# EAGLE board MicroBoardMk2 (EAGLE 7.2.0)
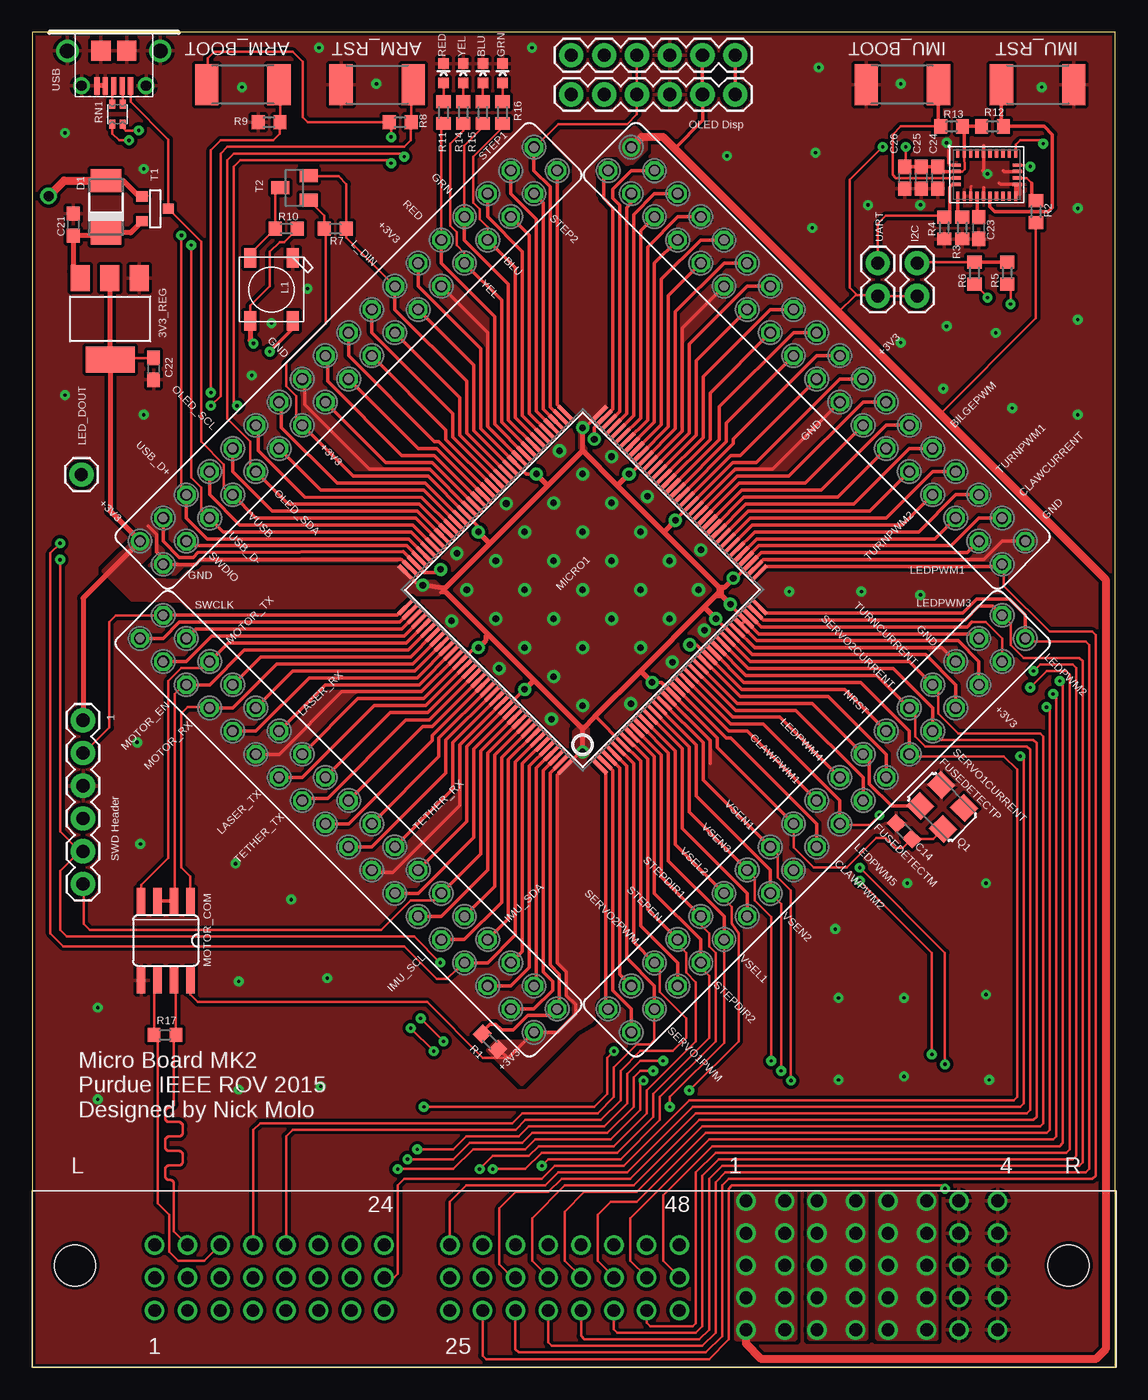
[diagram p4: board, top side]
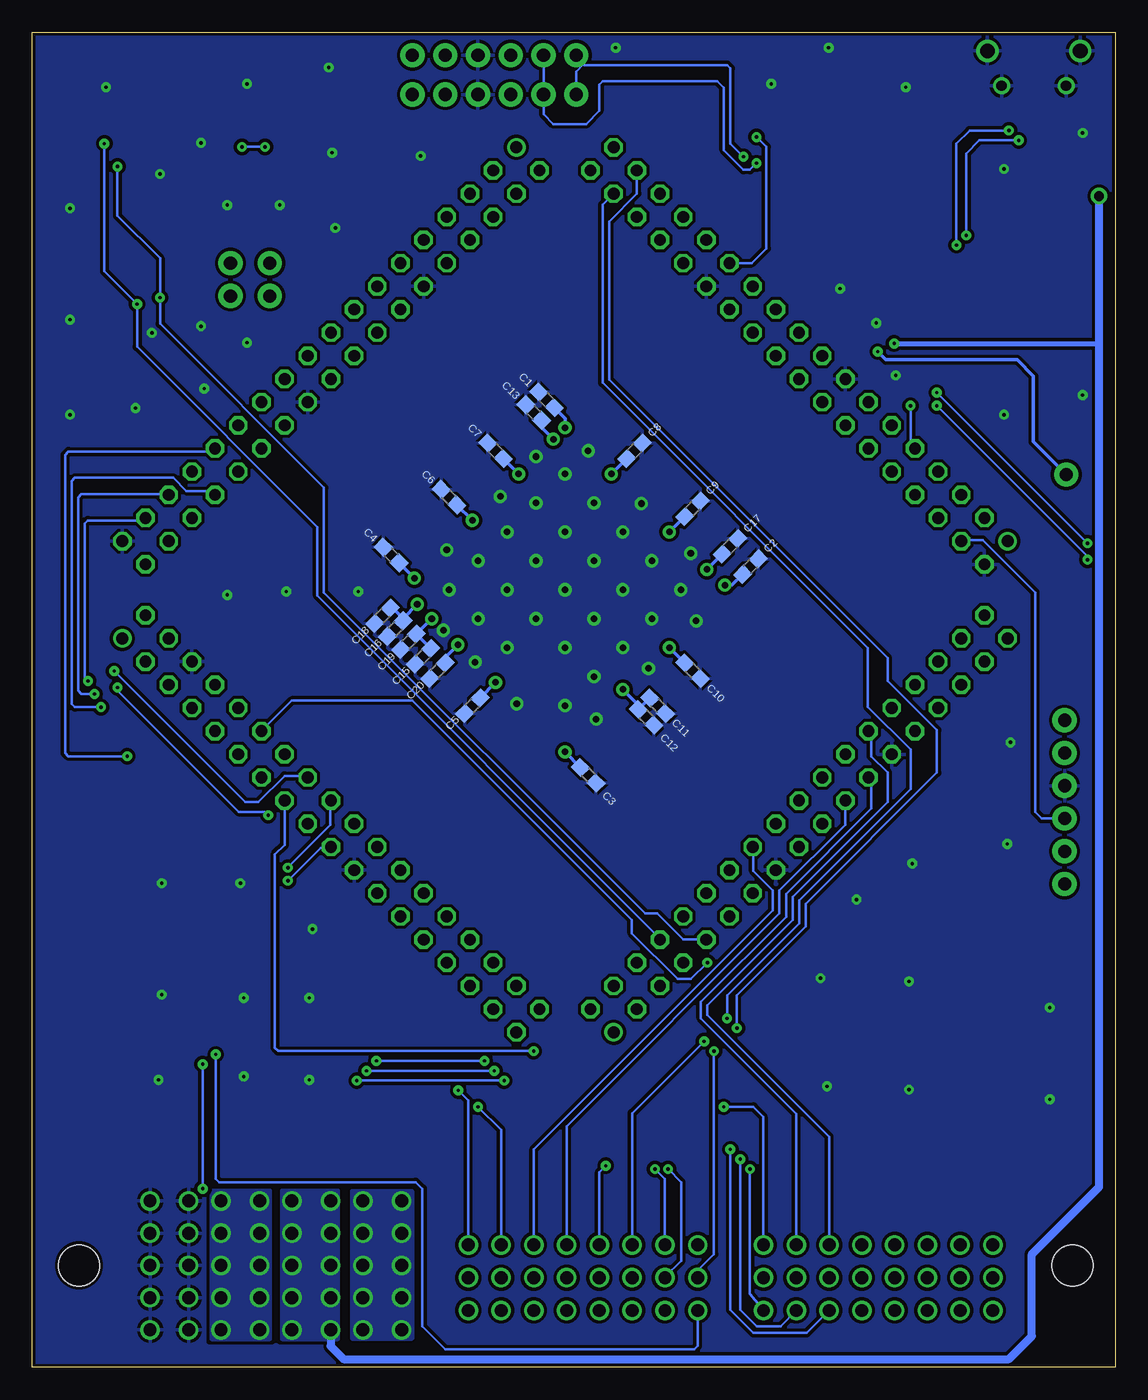
[diagram p5: board, bottom side, seen from below]

Size 83.95 x 103.5 mm. Coordinates in mm from the lower left corner, seen from the top.
Outline: 0,0 83.95,0 83.95,103.5 0,103.5 0,0
Copper layers (1*16): Top 0.035mm / dielectric 1.5mm / Bottom 0.035mm
Design rules "GoldPhoenix *": minimum track width 7mil, minimum drill 10mil, track to track 7mil, track to pad 7mil, pad to pad 7mil, via to via 7mil, smd to smd 7mil, copper to edge 10mil, drill to drill 8mil, minimum pad ring 10mil, minimum via ring 10mil, stop-mask expansion 4mil, vias tented up to drill 25mil, thermal gap 10mil

## Footprints (pad centres in the part's own frame; a part is rotated, then mirrored left to right if it is on the bottom)
SOT223 = smd 1.499 x 2.007: 1 -2.261,-3.15; 2 0.025,-3.15; 3 2.311,-3.15 | smd 3.81 x 2.007: 4 0,3.15
TEN60-S24-S24-P4-RA = drill 1: P1.1 55.32,12.9; P1.2 55.32,10.4; P1.3 55.32,7.9; P1.4 55.32,5.4; P1.5 55.32,2.9; P1.6 58.32,2.9; P1.7 58.32,5.4; P1.8 58.32,7.9; P1.9 58.32,10.4; P1.10 58.32,12.9; P2.1 60.82,12.9; P2.2 60.82,10.4; P2.3 60.82,7.9; P2.4 60.82,5.4; P2.5 60.82,2.9; P2.6 63.82,2.9; P2.7 63.82,5.4; P2.8 63.82,7.9; P2.9 63.82,10.4; P2.10 63.82,12.9; P3.1 66.32,12.9; P3.2 66.32,10.4; P3.3 66.32,7.9; P3.4 66.32,5.4; P3.5 66.32,2.9; P3.6 69.32,2.9; P3.7 69.32,5.4; P3.8 69.32,7.9; P3.9 69.32,10.4; P3.10 69.32,12.9; P4.1 71.82,12.9; P4.2 71.82,10.4; P4.3 71.82,7.9; P4.4 71.82,5.4; P4.5 71.82,2.9; P4.6 74.82,2.9; P4.7 74.82,5.4; P4.8 74.82,7.9; P4.9 74.82,10.4; P4.10 74.82,12.9; S1 9.49,4.4; S2 12.03,4.4; S3 14.57,4.4; S4 17.11,4.4; S5 19.65,4.4; S6 22.19,4.4; S7 24.73,4.4; S8 27.27,4.4; S9 9.49,6.94; S10 12.03,6.94; S11 14.57,6.94; S12 17.11,6.94; S13 19.65,6.94; S14 22.19,6.94; S15 24.73,6.94; S16 27.27,6.94; S17 9.49,9.48; S18 12.03,9.48; S19 14.57,9.48; S20 17.11,9.48; S21 19.65,9.48; S22 22.19,9.48; S23 24.73,9.48; S24 27.27,9.48; S25 32.37,4.4; S26 34.91,4.4; S27 37.45,4.4; S28 39.99,4.4; S29 42.53,4.4; S30 45.07,4.4; S31 47.61,4.4; S32 50.15,4.4; S33 32.37,6.94; S34 34.91,6.94; S35 37.45,6.94; S36 39.99,6.94; S37 42.53,6.94; S38 45.07,6.94; S39 47.61,6.94; S40 50.15,6.94; S41 32.37,9.48; S42 34.91,9.48; S43 37.45,9.48; S44 39.99,9.48; S45 42.53,9.48; S46 45.07,9.48; S47 47.61,9.48; S48 50.15,9.48 | hole 3.2: 3.32,7.9; 80.32,7.9
LED-0603 = smd 0.8 x 0.8: A 0,-0.75; C 0,0.75
LGA28 = smd 0.25 x 0.675: P$1 -2.25,1.663; P$6 -2.25,-1.663; P$7 -1.75,-1.663; P$8 -1.25,-1.663; P$9 -0.75,-1.663; P$10 -0.25,-1.663; P$11 0.25,-1.663; P$12 0.75,-1.663; P$13 1.25,-1.663; P$14 1.75,-1.663; P$15 2.25,-1.663; P$20 2.25,1.663; P$21 1.75,1.663; P$22 1.25,1.663; P$23 0.75,1.663; P$24 0.25,1.663; P$25 -0.25,1.663; P$26 -0.75,1.663; P$27 -1.25,1.663; P$28 -1.75,1.663 | smd 0.675 x 0.25: P$2 -2.362,0.75; P$3 -2.362,0.25; P$4 -2.362,-0.25; P$5 -2.362,-0.75; P$16 2.362,-0.75; P$17 2.362,-0.25; P$18 2.362,0.25; P$19 2.362,0.75
SW_2512 = smd 1.8 x 3.2: 1 -2.8,0; 2 2.8,0
C0603 = smd 1.1 x 1: 1 -0.85,0; 2 0.85,0
DO-214AC = smd 1.8 x 2.4: A 2.025,0; C -2.025,0
MICRO_B = smd 1.5 x 1.55: GND1 -1,1.45; GND2 1,1.45 | drill 0.8: GND3 -2.5,4.15; GND4 2.5,4.15 | drill 1.15: GND7 -3.598,1.45; GND8 3.598,1.45 | smd 0.4 x 1.35: P1 -1.3,4.15; P2 -0.65,4.15; P3 0,4.15; P4 0.65,4.15; P5 1.3,4.15
1X01 = drill 1.016 pad 1.88: 1 0,0
1X06 = drill 1.016 pad 1.88: 1 0,0; 2 2.54,0; 3 5.08,0; 4 7.62,0; 5 10.16,0; 6 12.7,0
1X02 = drill 1.016 pad 1.88: 1 0,0; 2 2.54,0
WS2812B = smd 1.5 x 0.9: 1-VDD 2.45,-1.65; 2-DOUT 2.45,1.65; 3-GND -2.45,1.65; 4-DIN -2.45,-1.65
SQFP-S-20X20-144 = smd 0.3 x 1.6: 1 -8.75,-10.6; 2 -8.25,-10.6; 3 -7.75,-10.6; 4 -7.25,-10.6; 5 -6.75,-10.6; 6 -6.25,-10.6; 7 -5.75,-10.6; 8 -5.25,-10.6; 9 -4.75,-10.6; 10 -4.25,-10.6; 11 -3.75,-10.6; 12 -3.25,-10.6; 13 -2.75,-10.6; 14 -2.25,-10.6; 15 -1.75,-10.6; 16 -1.25,-10.6; 17 -0.75,-10.6; 18 -0.25,-10.6; 19 0.25,-10.6; 20 0.75,-10.6; 21 1.25,-10.6; 22 1.75,-10.6; 23 2.25,-10.6; 24 2.75,-10.6; 25 3.25,-10.6; 26 3.75,-10.6; 27 4.25,-10.6; 28 4.75,-10.6; 29 5.25,-10.6; 30 5.75,-10.6; 31 6.25,-10.6; 32 6.75,-10.6; 33 7.25,-10.6; 34 7.75,-10.6; 35 8.25,-10.6; 36 8.75,-10.6; 73 8.75,10.6; 74 8.25,10.6; 75 7.75,10.6; 76 7.25,10.6; 77 6.75,10.6; 78 6.25,10.6; 79 5.75,10.6; 80 5.25,10.6; 81 4.75,10.6; 82 4.25,10.6; 83 3.75,10.6; 84 3.25,10.6; 85 2.75,10.6; 86 2.25,10.6; 87 1.75,10.6; 88 1.25,10.6; 89 0.75,10.6; 90 0.25,10.6; 91 -0.25,10.6; 92 -0.75,10.6; 93 -1.25,10.6; 94 -1.75,10.6; 95 -2.25,10.6; 96 -2.75,10.6; 97 -3.25,10.6; 98 -3.75,10.6; 99 -4.25,10.6; 100 -4.75,10.6; 101 -5.25,10.6; 102 -5.75,10.6; 103 -6.25,10.6; 104 -6.75,10.6; 105 -7.25,10.6; 106 -7.75,10.6; 107 -8.25,10.6; 108 -8.75,10.6 | smd 1.6 x 0.3: 37 10.6,-8.75; 38 10.6,-8.25; 39 10.6,-7.75; 40 10.6,-7.25; 41 10.6,-6.75; 42 10.6,-6.25; 43 10.6,-5.75; 44 10.6,-5.25; 45 10.6,-4.75; 46 10.6,-4.25; 47 10.6,-3.75; 48 10.6,-3.25; 49 10.6,-2.75; 50 10.6,-2.25; 51 10.6,-1.75; 52 10.6,-1.25; 53 10.6,-0.75; 54 10.6,-0.25; 55 10.6,0.25; 56 10.6,0.75; 57 10.6,1.25; 58 10.6,1.75; 59 10.6,2.25; 60 10.6,2.75; 61 10.6,3.25; 62 10.6,3.75; 63 10.6,4.25; 64 10.6,4.75; 65 10.6,5.25; 66 10.6,5.75; 67 10.6,6.25; 68 10.6,6.75; 69 10.6,7.25; 70 10.6,7.75; 71 10.6,8.25; 72 10.6,8.75; 109 -10.6,8.75; 110 -10.6,8.25; 111 -10.6,7.75; 112 -10.6,7.25; 113 -10.6,6.75; 114 -10.6,6.25; 115 -10.6,5.75; 116 -10.6,5.25; 117 -10.6,4.75; 118 -10.6,4.25; 119 -10.6,3.75; 120 -10.6,3.25; 121 -10.6,2.75; 122 -10.6,2.25; 123 -10.6,1.75; 124 -10.6,1.25; 125 -10.6,0.75; 126 -10.6,0.25; 127 -10.6,-0.25; 128 -10.6,-0.75; 129 -10.6,-1.25; 130 -10.6,-1.75; 131 -10.6,-2.25; 132 -10.6,-2.75; 133 -10.6,-3.25; 134 -10.6,-3.75; 135 -10.6,-4.25; 136 -10.6,-4.75; 137 -10.6,-5.25; 138 -10.6,-5.75; 139 -10.6,-6.25; 140 -10.6,-6.75; 141 -10.6,-7.25; 142 -10.6,-7.75; 143 -10.6,-8.25; 144 -10.6,-8.75
SO08 = smd 0.66 x 2.032: 1 -1.905,-3.073; 2 -0.635,-3.073; 3 0.635,-3.073; 4 1.905,-3.073; 5 1.905,3.073; 6 0.635,3.073; 7 -0.635,3.073; 8 -1.905,3.073
FE18-2 = drill 0.914: 1 -21.59,1.27 | drill 0.914 octagon: 2 -21.59,-1.27; 3 -19.05,1.27; 4 -19.05,-1.27; 5 -16.51,1.27; 6 -16.51,-1.27; 7 -13.97,1.27; 8 -13.97,-1.27; 9 -11.43,1.27; 10 -11.43,-1.27; 11 -8.89,1.27; 12 -8.89,-1.27; 13 -6.35,1.27; 14 -6.35,-1.27; 15 -3.81,1.27; 16 -3.81,-1.27; 17 -1.27,1.27; 18 -1.27,-1.27; 19 1.27,1.27; 20 1.27,-1.27; 21 3.81,1.27; 22 3.81,-1.27; 23 6.35,1.27; 24 6.35,-1.27; 25 8.89,1.27; 26 8.89,-1.27; 27 11.43,1.27; 28 11.43,-1.27; 29 13.97,1.27; 30 13.97,-1.27; 31 16.51,1.27; 32 16.51,-1.27; 33 19.05,1.27; 34 19.05,-1.27; 35 21.59,1.27; 36 21.59,-1.27
ASF = smd 1.6 x 1.5: 1 -1.25,-1.15; 2 1.25,-1.15; 3 1.25,1.15; 4 -1.25,1.15
R0603 = smd 1 x 1.1: 1 -0.85,0; 2 0.85,0
EXBV4V = smd 0.45 x 0.7: 1 -0.4,-0.775; 2 0.4,-0.775; 3 0.4,0.775; 4 -0.4,0.775
SOT-23 = smd 0.787 x 0.889: 1 0.025,-1.016; 2 -0.94,1.016; 3 0.991,1.016
SOT23 = smd 1 x 1.4: 1 -0.95,-1.1; 2 0.95,-1.1; 3 0,1.1

## Placement (x,y rotation side)
3V3_REG  AP1117-3.3SOT223  [SOT223]  6.03,81.28 180 top
BACKPLANECON_  TEN60-S24-S24-P4-RA  [TEN60-S24-S24-P4-RA]  0,0 0 top
BLU  [LED-0603]  34.92,100.33 0 top
BNO055  BNO055  [LGA28]  73.98,92.46 0 top
BNO_BOOT_SW  SWITCH  [SW_2512]  67.44,99.44 180 top
BNO_RST_SW  SWITCH  [SW_2512]  77.91,99.44 0 top
BOOT_SW  SWITCH  [SW_2512]  16.32,99.44 180 top
C1  0.1uF  [C0603]  44.09,75.01 135 bottom
C2  0.1uF  [C0603]  28.29,62.07 45 bottom
C3  0.1uF  [C0603]  40.86,45.91 315 bottom
C4  0.1uF  [C0603]  56.13,62.97 135 bottom
C5  0.1uF  [C0603]  49.84,51.3 225 bottom
C6  0.1uF  [C0603]  51.64,67.46 135 bottom
C7  0.1uF  [C0603]  48.05,71.05 135 bottom
C8  0.1uF  [C0603]  37.27,71.05 45 bottom
C9  0.1uF  [C0603]  32.78,66.56 45 bottom
C10  0.1uF  [C0603]  32.78,53.99 315 bottom
C11  0.1uF  [C0603]  35.47,51.3 315 bottom
C12  4.7uF  [C0603]  36.37,50.4 315 bottom
C13  2.2uF  [C0603]  45.08,74.02 135 bottom
C14  0.01uF  [C0603]  67.58,41.57 135 top
C15  1uF  [C0603]  53.66,55.11 225 bottom
C16  10nF  [C0603]  55.81,57.27 225 bottom
C17  2.2uF  [C0603]  29.86,63.65 45 bottom
C18  1uF  [C0603]  56.8,58.26 225 bottom
C19  10nF  [C0603]  54.78,56.24 225 bottom
C20  0.1uF  [C0603]  52.54,53.99 225 bottom
C21  0.22uF  [C0603]  3.17,88.58 90 top
C22  0.22uF  [C0603]  9.4,77.41 270 top
C23  0.1uF  [C0603]  73.34,88.33 270 top
C24  0.1uF  [C0603]  70.17,92.21 270 top
C25  6.8nF  [C0603]  68.9,92.21 270 top
C26  120nF  [C0603]  67.63,92.21 270 top
D1  S1M-E3/61T  [DO-214AC]  5.71,89.98 90 top
GRN  [LED-0603]  36.45,100.33 0 top
JP1  MICROUSB  [MICRO_B]  6.32,103.5 180 top
JP2  M01PTH  [1X01]  3.81,69.22 0 top
JP4  [1X06]  41.78,98.68 0 top
JP5  [1X06]  41.78,101.73 0 top
JP6  [1X02]  68.58,83.06 90 top
JP7  [1X06]  3.94,50.16 270 top
JP8  [1X02]  65.53,85.6 270 top
L1  WS2812B  [WS2812B]  18.54,83.57 270 top
MICRO1  [SQFP-S-20X20-144]  42.66,60.28 45 top
MOTOR_COM  MAX481CSA  [SO08]  10.35,33.08 180 top
P1  [FE18-2]  24.52,42.14 135 top
P2  [FE18-2]  24.52,78.42 45 top
P3  [FE18-2]  60.8,78.42 315 top
P4  [FE18-2]  60.8,42.14 225 top
Q1  ASV-8  [ASF]  70.53,43.44 135 top
R1  0 Ohm  [R0603]  35.47,25.26 315 top
R2  4.7K  [R0603]  77.79,89.6 270 top
R3  4.7K  [R0603]  72.07,88.33 90 top
R4  4.7K  [R0603]  70.68,88.33 90 top
R5  4.7K  [R0603]  75.56,84.84 90 top
R6  4.7K  [R0603]  73.03,84.84 90 top
R7  10K  [R0603]  23.5,88.27 180 top
R8  10K  [R0603]  28.51,96.52 180 top
R9  10K  [R0603]  18.35,96.52 180 top
R10  10K  [R0603]  19.68,88.27 0 top
R11  82  [R0603]  31.88,97.28 270 top
R12  4.7K  [R0603]  74.42,96.2 180 top
R13  4.7K  [R0603]  71.25,96.2 0 top
R14  82  [R0603]  33.4,97.28 270 top
R15  82  [R0603]  34.92,97.28 270 top
R16  10  [R0603]  36.45,97.28 270 top
R17  120  [R0603]  10.29,25.78 180 top
RED  [LED-0603]  31.88,100.33 0 top
RN1  [EXBV4V]  6.6,97.16 180 top
RST_SW  SWITCH  [SW_2512]  26.73,99.44 0 top
T1  FDN340P  [SOT-23]  9.53,89.79 90 top
T2  BSS138  [SOT23]  20.32,91.44 90 top
YEL  [LED-0603]  33.4,100.33 0 top

## Tracks (layer width: path | path; a pad name or v marks a point on that pad's centre or on a via)
+3V3  (via drill 0.25, 0.51)
  Top 0.203: BNO055.P$28 72.25,94.1 72.25,94.02 72.25,92.89 72.07,92.71 BNO055.P$3 | Q1.4 69.82,40.97 C14.1 67.47,40.26 66.93,40.26 66.17,41.02 65.41,41.02 63.12,38.73 60.58,38.73 59,40.31 P4.20 | C22.1 6.16,78.26 3V3_REG.4 | v27.81,95.38 27.81,96.37 R8.2 21.34,96.52 20.95,96.9 20.95,101.22 20.19,101.98 14.1,101.98 13.59,101.47 13.59,99.51 BOOT_SW.2 | v65.91,94.61 63.37,92.08 63.37,83.69 63.94,83.12 | v67.69,94.61 67.69,93.13 C26.1 | R2.2 77.79,81.34 70.36,73.91 | R7.2 22.64,89.27 T2.1 | 22.73,88.18 22.73,80.9 19.68,77.85 19.68,76.07 20.45,75.31 20.45,73.51 P2.14 | MOTOR_COM.8 12.26,28.89 12.83,28.32 30.61,28.32 34.92,24 36.87,24 36.89,23.98 | 51.97,98.65 JP4.5 | 63.94,83.12 65.47,83.12 JP8.2 JP6.1 | 63.94,83.12 63.82,83.12 62.48,81.79
  Top 0.254: P2.25 29.91,83.81 34.75,78.96 34.75,72.78 MICRO1.84 38.27,69.26 v39.06,69.26 | P2.14 24.88,69.08 30.67,69.08 MICRO1.95 34.58,65.18 v34.58,64.77 | P1.24 25.23,51.84 30.33,51.84 MICRO1.121 34.28,55.79 v34.58,55.79 | P1.14 33.68,42.32 33.68,48.12 MICRO1.131 38.12,52.55 v38.17,52.55 | P4.31 50.02,31.36 47.15,34.23 47.15,46.99 45.77,48.36 MICRO1.6 43.7,50.4 43.55,50.4 | P4.20 53.07,48.06 53.07,48.78 48.76,53.09 v48.05,53.09 48.78,53.09 MICRO1.17 | P4.7 71.57,52.91 69.24,55.25 55.82,55.25 MICRO1.30 54.17,56.85 v52.98,58.03 | P4.5 73.37,54.71 71.75,56.33 56.15,56.33 MICRO1.32 MICRO1.33 | MICRO1.33 56.32,56.87 73.01,56.87 P4.4 | P3.34 72.47,63.15 56.49,63.15 MICRO1.39 54.52,61.18 v54.33,61.18 | P3.21 62.59,76.62 56.13,70.16 54.3,70.16 MICRO1.52 C6.1 v49.84,65.67 | P3.11 53.61,85.6 49.84,81.83 49.84,72.77 MICRO1.62 46.33,69.26 v46.25,69.26 | 52.18,58.84 52.18,59.02 | 48.94,64.77 48.94,64.8 48.97,64.8 | 38.71,53.09 39.06,53.09 | 35.18,56.69 35.47,56.69 | v42.66,47.71 42.46,47.71 MICRO1.144 | MICRO1.144 40.68,45.93 40.68,31.36 41.4,30.64 41.4,28.85 42.12,28.13 42.12,27.41 40.68,25.97 P1.1 36.89,23.98 R1.2 | MICRO1.144 42.66,47.9 | v30.26,60.64 29.91,60.64 28.98,61.57 MICRO1.108 | v42.66,72.85 42.85,72.85 MICRO1.72 | MICRO1.33 54.11,59.08 v54.11,59.16 | 53.25,60.01 53.16,60.01 | 32.1,60.05 31.66,60.05 | 32.1,60.5 31.66,60.5 | 70.22,41.74 Q1.4 | R12.2 R13.2 72.23,95.82 BNO055.P$28 | BNO055.P$3 70.45,92.71 C24.1 C25.1 C26.1 | 49.78,94.49 51.97,96.67 51.97,98.65 | 22.73,88.18 R7.2 | JP4.5 JP5.5
  Top 0.406: 53.43,60.28 53.25,60.1 | 52.98,59.83 53.16,60.01 53.25,60.1 | 52.98,59.83 52.18,59.02 52.09,58.93 | 52.09,58.93 47.15,53.99 | 47.15,53.99 43.55,50.4 42.66,49.5 | 42.66,49.5 39.06,53.09 35.47,56.69 32.1,60.05 31.88,60.28 | 31.88,60.28 32.1,60.5 35.47,63.87 | 35.47,63.87 39.96,68.36 | 39.96,68.36 42.66,71.05 | 42.66,71.05 45.35,68.36 | 45.35,68.36 48.94,64.77 53.25,60.46 | 53.25,60.46 53.43,60.28 | v38.17,52.55 38.71,53.09 | v34.58,55.79 35.18,56.39 35.18,56.69 | v34.58,64.77 35.47,63.87 | v39.06,69.26 39.96,68.36 | v46.25,69.26 45.35,68.36 | v49.84,65.67 48.97,64.8 | 47.15,53.99 v48.05,53.09 | v54.33,61.18 53.61,60.46 | 53.61,60.46 53.43,60.28 | 42.66,47.9 42.66,49.5 | 31.88,60.28 31.75,60.41 v30.26,60.64 | 42.66,71.05 v42.66,72.85 | v54.11,59.16 53.25,60.01 | 52.09,58.93 v52.98,58.03 | 52.98,59.83 53.34,59.83 53.43,59.92 53.43,60.28 | 53.61,60.46 53.25,60.46 | 53.25,60.1 53.25,60.46 | 3V3_REG.2 6.01,78.16 3V3_REG.4 6.03,66.37 P2.1 3.94,59.63 JP7.1
  Top 0.61: BACKPLANECON_.P1.5 55.32,1.83 56.52,0.64 82.42,0.64 83.19,1.4 83.19,61.09 70.36,73.91 62.48,81.79 49.78,94.49 48.9,95.38 47.22,95.38 P3.1
  Bottom 0.203: v65.91,94.61 v67.69,94.61 | P2.25 28.19,85.6 27.05,86.74 27.05,94.61 v27.81,95.38
  Bottom 0.254: 37.96,52.35 v38.17,52.55 36.97,51.36 C12.1 C11.1 | C10.1 v34.58,55.79 | v34.58,64.77 C9.1 | v39.06,69.26 C8.1 | v46.25,69.26 C7.1 | C6.1 v49.84,65.67 | C4.1 v54.33,61.18 | C3.1 v42.66,47.71 | C2.1 29.73,60.64 v30.26,60.64 | C1.1 42.66,73.57 v42.66,72.85 | C15.1 C19.1 v52.98,58.03 | v54.11,59.16 55.21,58.05 | 55.21,58.05 C16.1 | 55.21,58.05 56.02,58.86 C18.1 | C5.1 v48.05,53.09
  pour Top (isolate 0.305, no thermals): 31.88,60.28 31.52,59.92 29.01,59.92 29.01,59.56 28.29,58.84 12.12,58.84 11.59,59.38 7.72,59.47 5.48,61.71 8.44,64.68 9.61,63.51 8.26,62.16 9.34,61.09 11.41,61 12.12,61.71 12.84,61.71 13.2,62.07 28.47,62.07 29.64,60.91 31.25,60.91
  pour Top (isolate 0.305, no thermals): 59.12,2.22 59.12,13.65 54.55,13.65 54.55,2.22
  pour Top (isolate 0.305, no thermals): 42.88,70.83 42.88,73.07 44.45,74.65 44.45,89.91 43.56,90.81 43.56,93.06 44.45,93.95 45.35,93.95 46.02,93.28 46.47,93.28 47.6,94.4 47.6,95.3 46.7,96.2 41.31,96.2 40.41,95.3 40.41,94.85 41.98,93.28 41.98,91.93 41.09,91.04 41.09,74.87 42.43,73.52 42.43,71.28
  pour Top (isolate 0.305, no thermals): 41.98,49.28 42.43,49.73 42.88,49.73 43.11,49.5 43.11,46.81 44,45.91 44,28.85 43.56,28.4 43.56,27.05 43.33,26.83 42.21,26.15 37.94,21.89 35.25,24.58 35.92,25.26 38.17,25.26 38.84,25.93 40.64,25.93 41.98,27.28 41.98,28.17 41.31,28.85 41.31,30.64 40.64,31.32 40.64,45.69 42.21,47.26 42.21,47.71 41.98,47.93
  pour Bottom (isolate 0.305, no thermals): 59.12,2.22 59.12,13.65 54.55,13.65 54.55,2.22
+5V  (via drill 0.25, 0.76)
  Top 0.203: L1.1-VDD 16.89,82.3 18.41,83.82 18.41,86.49 19.18,87.25 19.52,87.25 R10.2
  Top 0.406: T1.3 8.8,90.81 8.26,90.81 7.06,92 D1.A | L1.1-VDD 16.89,79.63 v17.14,79.38
  Top 0.61: v1.27,90.81 2.47,92 D1.A
  Bottom 0.406: v17.14,79.38 1.27,79.38
  Bottom 0.61: v1.27,90.81 1.27,79.38 1.27,13.97 6.48,8.76 6.48,2.41 8.26,0.64 59.82,0.64 60.82,1.64 BACKPLANECON_.P2.5
  pour Top (isolate 0.305, no thermals): 60.26,2.22 60.26,13.65 64.58,13.65 64.58,2.22
  pour Bottom (isolate 0.305, no thermals): 60.26,2.22 60.26,13.65 64.58,13.65 64.58,2.22
+12V
  pour Top (isolate 0.305, no thermals): 65.53,2.22 65.53,13.65 70.04,13.65 70.04,2.22
  pour Bottom (isolate 0.305, no thermals): 65.53,2.22 65.53,13.65 70.04,13.65 70.04,2.22
+48V_CURRENT
  Top 0.203: P4.11 68.14,47.37 75.31,47.37 76.33,46.35 76.33,20.95 76.07,20.7 50.93,20.7 45.85,15.62 40.51,15.62 39.5,14.61 28.83,14.61 28.32,14.1 28.32,7.24 28.07,6.99 27.32,6.99 BACKPLANECON_.S16
  Top 0.254: P4.11 67.98,49.32 64.21,53.09 55.15,53.09 MICRO1.26
BILGEPWM  (via drill 0.25)
  Top 0.203: BACKPLANECON_.S41 32.37,12.81 33.66,14.1 39.75,14.1 40.77,15.11 46.1,15.11 51.18,20.19 76.58,20.19 76.83,20.45 76.83,47.12 v76.58,47.37
  Top 0.254: P3.27 67.98,71.23 63.67,66.92 55.31,66.92 MICRO1.46
  Bottom 0.203: v76.58,47.37 81.15,47.37 81.41,47.62 81.41,70.74 81.15,70.99 70.02,70.99 P3.27
BNO055_SCL  (via drill 0.25)
  Top 0.203: BNO055.P$19 77.23,93.21 v77.34,93.09 | v74.04,82.93 74.04,82.97 R6.1
  Top 0.254: MICRO1.136 36.37,47.27 36.37,36.03 33.5,33.16 P1.9
  Bottom 0.203: v77.34,93.09 77.34,89.28 74.04,85.98 v74.04,82.93 74.04,80.9 61.34,68.2 61.34,60.07 36.45,35.18 35.52,35.18 33.5,33.16 P1.9
BNO055_SDA  (via drill 0.25)
  Top 0.203: BNO055.P$20 76.23,94.77 76.58,95.12 78.11,95.12 v78.36,94.87 | v75.82,82.42 75.82,83.73 R5.1
  Top 0.254: P1.8 36.91,34.77 36.91,47.11 MICRO1.137
  Bottom 0.203: v78.36,94.87 78.36,84.96 v75.82,82.42 75.82,79.12 61.85,65.15 61.85,59.82 35.69,33.66 35.69,33.55 P1.8
BOOT0  (via drill 0.25)
  Top 0.203: P1.7 33,30.86 32.89,30.86 32.13,30.1 31.37,30.1 28.83,32.64 2.41,32.64 1.4,33.66 1.4,63.12 v2.16,63.88 | BOOT_SW.1 19.2,99.36 R9.1 19.18,96.5 19.18,95.63 18.67,95.12 14.61,95.12 13.84,94.36 v13.84,75.56
  Top 0.254: MICRO1.138 37.45,46.94 37.45,33.52 35.29,31.36 P1.7
  Bottom 0.203: v2.16,63.88 v13.84,75.56
CLAWCURRENT  (via drill 0.25)
  Top 0.203: BACKPLANECON_.S40 50.15,7 48.9,8.26 48.9,13.34 52.7,17.14 79.63,17.14 79.88,17.4 79.88,52.96 v79.63,53.21
  Top 0.254: MICRO1.40 56.32,63.69 71.21,63.69 73.37,65.85 P3.33
  Bottom 0.203: v79.63,53.21 79.88,53.47 79.88,65.41 79.63,65.66 75.35,65.66 P3.33
CLAWPWM1  (via drill 0.25)
  Top 0.203: BACKPLANECON_.S26 34.91,0.9 35.18,0.64 52.45,0.64 53.98,2.16 53.98,13.84 54.23,14.1 70.48,14.1 v70.74,13.84 | v70.74,23.5 70.74,32.13 v64.14,38.73
  Top 0.254: P4.18 55.41,49.32 53.97,49.32 MICRO1.19
  Bottom 0.203: P4.18 60.83,43.9 60.83,42.04 v64.14,38.73 | v70.74,13.84 v70.74,23.5
CLAWPWM2  (via drill 0.25)
  Top 0.203: v69.72,24.26 69.72,32.13 v64.14,37.72
  Top 0.254: P4.19 60.8,42.14 54.15,48.78 53.79,48.78 MICRO1.18
  Bottom 0.203: BACKPLANECON_.S25 32.38,4.38 32.38,1.65 32.64,1.4 51.94,1.4 53.72,3.17 53.72,13.84 54.23,14.35 69.47,14.35 69.72,14.61 v69.72,24.26 | v64.14,37.72 61.59,40.26 60.88,40.26 P4.19
D+1
  Top 0.203: RN1.2 6.2,99.24 JP1.P3
D-1
  Top 0.203: RN1.1 7,99.32 JP1.P2
FUSEDETECTM  (via drill 0.25)
  Top 0.203: v45.09,24.51 44.58,24 44.58,21.21 43.56,20.19 v30.35,20.19
  Top 0.254: P4.15 64.39,45.73 59.18,50.94 54.51,50.94 51.43,54.02 MICRO1.22
  Bottom 0.203: v45.09,24.51 64.9,24.51 65.15,24.77 65.15,39.75 64.39,40.51 P4.15 | v30.35,20.19 28.07,20.19 27.3,19.43 27.3,9.52 BACKPLANECON_.S24 | P4.15
GND  (via drill 0.25, 0.51)
  Top 0.203: BNO055.P$25 73.74,94.11 | BNO055.P$2 71.13,93.21 70.99,93.34 70.99,94.36 | BNO055.P$8 72.73,91.52 72.77,91.57 | 76.33,91.69 76.2,91.69 76.2,90.93 76.23,90.9 BNO055.P$15 | 76.33,91.69 76.33,90.93 76.58,90.93 76.58,91.57 76.45,91.57 76.45,91.06 | 76.33,91.69 BNO055.P$16
  Top 0.254: P2.26 35.29,80.21 35.29,72.94 MICRO1.83 | P2.2 12.66,62.25 13.02,62.61 28.65,62.61 MICRO1.107 | P2.15 21.1,76.44 21.1,74.65 26.13,69.62 30.8,69.62 33.88,66.54 MICRO1.94 | P1.25 19.13,47.53 23.98,52.38 30.16,52.38 MICRO1.120 | P1.15 26.49,38.37 27.93,38.37 33.14,43.58 33.14,48.24 36.4,51.51 MICRO1.130 | 52.53,46.81 52.53,48.6 49.27,51.87 MICRO1.16 | P4.6 70.5,55.79 55.99,55.79 MICRO1.31 | P3.35 75.17,64.05 73.73,62.61 56.67,62.61 MICRO1.38 | P3.22 57.38,69.62 54.47,69.62 MICRO1.51 | P3.12 50.38,80.57 50.38,72.6 MICRO1.61 | BNO055.P$10 73.73,91.44 | BNO055.P$18 75.31,92.71 75.25,92.77 | BNO055.P$16 75.05,91.71 74.93,91.82 | BNO055.P$25 73.73,92.84 73.66,92.77 | 73.74,93.98 73.74,94.11 73.74,94.72 | 8.98,65.22 9.65,64.54 9.65,63.2 10.1,62.75 10.1,62.3
  Top 0.406: JP1.P4 JP1.P5
  other vias: 36.74,66.96 32.5,57.86 36.18,54.18 40.24,50.25 33.68,60.28 35.92,58.03 38.17,55.79 40.41,53.54 42.66,51.3 42.66,55.79 40.41,58.03 38.17,60.28 35.92,62.52 38.17,64.77 40.41,62.52 42.66,60.28 44.9,58.03 47.15,55.79 49.39,58.03 51.64,60.28 49.39,62.52 47.15,60.28 47.15,64.77 44.9,62.52 42.66,64.77 44.9,67.01 42.66,69.26 40.41,67.01 46.4,51.45 49.62,54.67 52.09,57.13 51.82,63.37 47.67,67.52 44.9,70.61 40.86,71.05 32.91,63.1 74.04,92.52 70.87,94.93 64.77,90.11 68.83,90.11 21.34,83.63 17.02,76.9 18.54,80.96 38.73,102.3 26.67,99.5 16.26,99.25 8.64,73.85 2.54,75.37 2.54,95.69 8.64,92.9 8.13,48.45 8.38,40.58 15.75,39.05 20.07,36.26 16,29.91 16,21.53 22.35,21.78 22.86,30.16 5.08,27.88 5.08,20.76 58.67,60.13 68.83,59.88 64.26,60.13 75.95,74.36 81.03,73.85 81.03,81.22 81.03,89.85 78.23,99.25 67.31,99.5 60.45,88.33 53.85,93.92 60.71,94.17 60.96,100.77 62.48,28.64 62.23,33.97 62.48,22.29 67.56,22.54 67.56,28.64 74.17,22.29 73.91,28.89 73.91,37.53 67.82,37.53 70.61,75.88 74.68,80.2 70.87,80.71 67.31,79.44 22.23,102.3
  pour Top (isolate 0.254, rank 6): 0,108.58 83.95,108.58 83.95,0 0,0
  pour Bottom (isolate 0.254, rank 6): 0,0 83.95,0 83.95,108.58 0,108.58
LASER_RX
  Top 0.254: MICRO1.119 29.99,52.91 22.72,52.91 P1.26
  Bottom 0.203: BACKPLANECON_.S22 22.19,17.87 31.62,27.3 31.62,28.07 25.02,34.67 25.02,36.45 17.65,43.81 17.65,46.1 18.92,47.37 18.92,49.12 P1.26
LASER_TX
  Top 0.254: MICRO1.122 30.5,51.3 26.49,51.3 20.93,45.73 P1.23
  Bottom 0.203: BACKPLANECON_.S23 24.73,19.65 32.13,27.05 32.13,28.32 25.53,34.92 25.53,36.7 18.92,43.31 18.92,45.52 P1.23
LED_BLUE
  Top 0.203: P2.30 35.29,88.41 34.67,89.03 34.67,89.79 34.16,90.3 34.16,93.85 36.45,96.14 R16.2
  Top 0.254: MICRO1.79 37.45,73.62 37.45,85.24 P2.30
LED_DIN_HV
  Top 0.203: 16.89,86.32 R10.1 18.84,91.06 T2.3
  Top 0.254: L1.4-DIN 16.89,86.32
LED_DIN_LV
  Top 0.203: 21.48,92.33 23.75,92.33 24.34,91.73 R7.1 24.34,87.57 P2.23
  Top 0.254: MICRO1.86 33.68,72.44 33.68,76.44 28.11,82.01 P2.23 | 21.48,92.33 T2.2
LED_DOUT_HV  (via drill 0.25)
  Top 0.254: L1.2-DOUT 20.19,80.52 v18.41,78.74
  Bottom 0.254: v18.41,78.74 17.78,78.11 7.62,78.11 6.35,76.83 6.35,71.75 JP2.1
LED_GREEN
  Top 0.203: P2.29 33.5,94.71 34.92,96.14 R15.2
  Top 0.254: MICRO1.80 36.91,73.45 36.91,83.99 33.5,87.4 P2.29
LED_RED
  Top 0.203: P2.27 31.7,96.89 R11.2
  Top 0.254: MICRO1.82 35.83,73.11 35.83,81.47 31.7,85.6 P2.27
LED_YELLOW
  Top 0.203: P2.28 33.5,86.39 32.89,87 32.89,88.01 32.38,88.52 32.38,94.87 33.4,95.89 R14.2
  Top 0.254: MICRO1.81 36.37,73.28 36.37,82.73 P2.28
LEDPWM1
  Top 0.203: BACKPLANECON_.S27 37.45,1.41 37.72,1.14 52.2,1.14 53.47,2.41 53.47,14.1 53.98,14.61 82.17,14.61 82.42,14.86 82.42,56.77 82.17,57.02 78.87,57.02 75.31,60.58 75.31,62.11 P3.36
  Top 0.254: P3.36 74.81,62.25 74.63,62.07 56.83,62.07 MICRO1.37
LEDPWM2
  Top 0.203: BACKPLANECON_.S28 39.99,1.92 40.26,1.65 51.94,1.65 52.96,2.67 52.96,14.35 53.72,15.11 81.66,15.11 81.92,15.37 81.92,56.01 81.66,56.26 77.21,56.26 P4.1
  Top 0.254: P4.1 76.96,58.3 75.7,59.56 73.19,59.56 72.11,58.48 56.83,58.48 MICRO1.36
LEDPWM3
  Top 0.203: BACKPLANECON_.S29 42.53,2.43 42.8,2.16 51.69,2.16 52.45,2.92 52.45,14.61 53.47,15.62 81.15,15.62 81.41,15.88 81.41,54.74 81.15,54.99 76.83,54.99 75.82,56.01 75.82,57.65 P4.2
  Top 0.254: P4.2 74.45,59.02 73.37,59.02 72.29,57.94 56.66,57.94 MICRO1.35
LEDPWM4  (via drill 0.25)
  Top 0.203: BACKPLANECON_.S30 45.07,2.94 45.34,2.67 51.44,2.67 51.94,3.17 51.94,14.86 53.21,16.13 80.64,16.13 80.9,16.38 80.9,54.23 80.64,54.48 78.11,54.48 v77.6,53.98
  Top 0.254: P4.16 57.92,50.4 54.3,50.4 MICRO1.21
  Bottom 0.203: P4.16 62.71,45.85 64.39,45.85 66.42,43.81 67.44,43.81 v77.6,53.98
LEDPWM5  (via drill 0.25)
  Top 0.203: BACKPLANECON_.S31 47.61,3.44 47.88,3.17 51.18,3.17 51.44,3.43 51.44,15.11 52.96,16.64 80.14,16.64 80.39,16.89 80.39,53.72 80.14,53.98 78.61,53.98 v77.34,52.7 | v65.66,42.8 64.9,42.04 62.69,42.04 P4.17
  Top 0.254: P4.17 62.59,43.93 56.67,49.86 54.15,49.86 50.7,53.31 MICRO1.20
  Bottom 0.203: v77.34,52.7 77.34,52.45 67.94,43.05 65.91,43.05 v65.66,42.8
MCOM_N
  Top 0.178: BACKPLANECON_.S18 10.99,10.52 10.99,14.21 arc90 10.67,14.52 10.62,14.52 arc-90 10.3,14.83 10.3,15.33 arc-90 10.62,15.64 11.36,15.64 arc90 11.67,15.96 11.67,16.46 arc90 11.36,16.77 10.62,16.77 arc-90 10.3,17.08 10.3,17.58 arc-90 10.62,17.89 11.36,17.89 arc90 11.67,18.2 11.67,18.7 arc90 11.36,19.01 10.62,19.01 arc-90 10.3,19.32 10.3,19.82 arc-90 10.62,20.14 10.67,20.14 arc90 10.99,20.45 10.99,25.63 R17.1 11.14,29.86 MOTOR_COM.7
MCOM_P
  Top 0.178: BACKPLANECON_.S19 13.35,8.26 11.3,8.26 10.62,8.94 10.62,11.81 9.72,12.71 9.72,25.5 R17.2 9.44,29.73 MOTOR_COM.6
MOTOR_EN
  Top 0.203: P1.31 11.77,52.91 11.05,52.2 11.05,36.22 MOTOR_COM.2
  Top 0.254: MICRO1.114 29.15,55.61 16.43,55.61 13.74,52.91 P1.31 | MOTOR_COM.2 MOTOR_COM.3
MOTOR_RX
  Top 0.203: MOTOR_COM.1 12.26,38.04 11.56,38.73 11.56,50.67 12.06,51.18 13.68,51.18 P1.29
  Top 0.254: MICRO1.116 29.48,54.53 18.95,54.53 15.54,51.12 P1.29
MOTOR_TX
  Top 0.203: MOTOR_COM.4 8.45,37.4 10.54,39.5 10.54,53.21 11.56,54.23 13.26,54.23 P1.32
  Top 0.254: MICRO1.113 28.98,56.15 15.18,56.15 P1.32
N$10
  Top 0.254: BNO055.P$9 73.23,89.29 C23.1
N$11
  Top 0.203: BNO055.P$17 77.08,92.21 77.47,91.82
  Top 0.254: 77.47,91.82 77.47,90.77 R2.1
N$12
  Top 0.203: R4.2 70.57,89.28 66.17,89.28 65.53,88.65 JP8.1
  Top 0.254: BNO055.P$5 71.32,91.71 71.12,91.5 71.12,89.62 R4.2
N$20
  Top 0.254: BNO055.P$6 71.73,89.52 R3.2
N$22
  Top 0.203: R6.2 68.67,85.69 JP6.2
  Top 0.254: R6.2 R5.2
N$26
  Top 0.203: BNO055.P$4 66.92,92.21 66.67,92.46 66.67,95.57 67.31,96.2 R13.1
  Top 0.254: R13.1 70.24,96.11 BNO_BOOT_SW.1
N$27
  Top 0.254: BNO055.P$11 74.23,89.98 74.61,89.6 78.74,89.6 79.06,89.92 79.06,95.57 78.42,96.2 R12.1 75.11,96.11 BNO_RST_SW.1
N$32
  Top 0.254: JP4.6 JP5.6
N$39
  Top 0.203: R16.1 GRN.A
N$40
  Top 0.203: R15.1 BLU.A
N$41
  Top 0.203: R14.1 YEL.A
N$42
  Top 0.203: R11.1 RED.A
NRST  (via drill 0.25, 0.51)
  Top 0.203: 3.68,40.01 2.16,38.48 2.16,33.91 2.67,33.4 29.59,33.4 v31.62,31.37 | v2.16,62.61 2.16,41.53 3.68,40.01 | 29.59,96.29 R8.1 | R8.1 29.36,99.27 RST_SW.2 | v13.84,74.55 14.61,75.31 14.61,94.11 15.11,94.61 28.83,94.61 29.34,95.12 29.34,96.5 R8.1 | 3.68,40.01 JP7.5
  Top 0.254: P4.12 62.95,52.55 54.98,52.55 MICRO1.25 51.52,56.01 v50.96,56.01
  Bottom 0.203: v31.62,31.37 32.89,30.1 33.91,30.1 37.47,33.66 37.47,34.67 54.48,51.69 63.82,51.69 P4.12 | v2.16,62.61 2.16,62.87 v13.84,74.55
  Bottom 0.254: v50.96,56.01 51.93,55.04 C20.1
OLED_RST
  Top 0.203: P2.35 38.96,94.58 40.77,96.39 46.1,96.39 46.86,97.16 JP4.3 JP5.3
  Top 0.254: MICRO1.74 40.14,74.46 40.14,91.53 38.88,92.79 P2.35
OLED_SCL  (via drill 0.25)
  Top 0.203: v15.88,74.55 15.62,74.8 15.62,93.09 16.13,93.6 27.56,93.6 v27.81,93.34
  Top 0.254: P2.9 15.54,69.44 18.59,66.39 29.83,66.39 MICRO1.100
  Bottom 0.203: v15.88,74.55 15.88,71.57 P2.9 | v27.81,93.34 28.32,92.84 28.83,92.84 30.35,94.36 30.35,99.19 30.86,99.69 39.75,99.69 40.01,99.44 40.01,97.41 41.02,96.39 43.56,96.39 44.32,97.16 JP4.2 JP5.2
OLED_SDA  (via drill 0.25)
  Top 0.203: P2.10 16.89,69.88 16.89,71.75 15.11,73.53 15.11,93.6 15.62,94.11 28.57,94.11 v28.83,93.85
  Top 0.254: MICRO1.99 30,66.92 19.85,66.92 P2.10
  Bottom 0.203: v28.83,93.85 29.84,94.87 29.84,100.71 30.1,100.97 41.17,100.97 41.22,101.02 | 41.22,101.02 41.78,100.46 JP4.1 | 41.22,101.02 41.78,101.58 JP5.1
PA0-WKUP
  Top 0.203: 72.83,57.76 73.91,57.76 75.17,56.51 P4.3
  Top 0.254: MICRO1.34 56.49,57.4 72.47,57.4 72.83,57.76
PA5
  Top 0.254: MICRO1.41 56.15,64.23 69.96,64.23 P3.32
PA10
  Top 0.254: MICRO1.102 29.5,65.31 16.08,65.31 13.74,67.64 P2.7
PA15
  Top 0.254: MICRO1.110 28.48,57.76 11.41,57.76 10.15,56.51 P1.35
PB1
  Top 0.254: MICRO1.47 55.15,67.46 62.41,67.46 P3.26
PB2
  Top 0.254: MICRO1.48 54.98,68 61.16,68 66.19,73.03 P3.25
PB4
  Top 0.254: MICRO1.134 35.29,47.61 35.29,38.55 31.7,34.95 P1.11
PB5
  Top 0.254: P1.10 35.83,37.29 35.83,47.45 38.08,49.71 MICRO1.135
PB8
  Top 0.254: P1.6 37.99,32.26 37.99,46.81 39.54,48.36 MICRO1.139
PB9
  Top 0.254: MICRO1.140 38.53,46.6 38.53,31 37.09,29.57 P1.5
PB10
  Top 0.254: MICRO1.69 46.07,73.94 46.07,89.91 46.43,90.27 P3.4
PB11
  Top 0.254: P3.3 46.43,92.79 44.99,91.35 44.99,90.63 45.53,90.09 45.53,74.11 MICRO1.70
PB12
  Top 0.254: MICRO1.73 40.68,74.63 P2.36
PC4
  Top 0.254: MICRO1.44 55.65,65.85 66.19,65.85 69.78,69.44 P3.29
PC5
  Top 0.254: MICRO1.45 55.48,66.39 64.93,66.39 P3.28
PC6
  Top 0.254: P2.13 19.31,74.65 19.31,72.85 23.62,68.54 30.44,68.54 33.16,65.83 MICRO1.96
PC7
  Top 0.254: P2.12 22.36,68 30.34,68 MICRO1.97
PC8
  Top 0.254: P2.11 17.51,72.85 17.51,71.05 21.1,67.46 30.19,67.43 32.53,65.09 MICRO1.98
PC10
  Top 0.254: MICRO1.111 28.64,57.23 12.66,57.23 P1.34
PC11
  Top 0.254: MICRO1.112 28.81,56.69 13.92,56.69 11.95,54.71 P1.33
PD1
  Top 0.254: MICRO1.115 29.32,55.07 17.69,55.07 P1.30
PD3
  Top 0.254: MICRO1.117 29.65,53.99 20.21,53.99 P1.28
PD4
  Top 0.254: MICRO1.118 29.82,53.45 21.46,53.45 17.33,49.32 P1.27
PD7
  Top 0.254: MICRO1.123 30.66,50.76 27.75,50.76 P1.22
PD8
  Top 0.254: MICRO1.77 38.53,73.95 38.53,87.76 P2.32
PD9
  Top 0.254: MICRO1.78 37.99,73.79 37.99,86.5 35.29,89.19 P2.31
PD14
  Top 0.254: MICRO1.85 34.22,72.61 34.22,77.7 P2.24
PDR_ON
  Top 0.254: MICRO1.143 40.14,46.09 40.14,31.18 40.86,30.46 40.86,27.95 P1.2 40.19,27.28 38.39,27.28 37.27,26.15 36.37,26.15 35.92,26.6 35.47,26.6 34.87,26 R1.1
PE0
  Top 0.254: P1.4 39.06,29.75 39.06,46.45 40.27,47.66 MICRO1.141
PE1
  Top 0.254: MICRO1.142 39.6,46.27 39.6,30.64 40.32,29.93 40.32,29.21 38.88,27.77 P1.3
PE2
  Top 0.254: P4.36 44.45,27.95 44.45,46.09 43.97,46.58 MICRO1.1
PE3
  Top 0.254: P4.35 46.43,27.77 44.99,29.21 44.99,46.27 MICRO1.2
PE4
  Top 0.254: P4.34 45.53,30.46 45.53,46.45 MICRO1.3
PE7
  Top 0.254: MICRO1.58 52,72.09 52,76.8 57.2,82.01 P3.15
PE8
  Top 0.254: MICRO1.59 51.46,72.26 51.46,78.06 P3.14
PE9
  Top 0.254: MICRO1.60 50.92,72.43 50.92,79.32 55.41,83.81 P3.13
PE10
  Top 0.254: MICRO1.63 49.3,72.93 49.3,83.09 P3.10
PE11
  Top 0.254: MICRO1.64 48.76,73.1 48.76,84.34 51.82,87.4 P3.9
PE12
  Top 0.254: MICRO1.65 48.23,73.27 48.23,85.6 P3.8
PE13
  Top 0.254: MICRO1.66 47.69,73.44 47.69,86.86 50.02,89.19 P3.7
PE14
  Top 0.254: MICRO1.67 47.15,73.61 47.15,88.12 P3.6
PE15
  Top 0.254: MICRO1.68 46.61,73.78 46.61,89.37 48.23,90.99 P3.5
PF2
  Top 0.254: P4.25 55.41,36.75 50.38,41.78 50.38,47.96 MICRO1.12
PF11
  Top 0.254: MICRO1.49 54.81,68.54 59.9,68.54 P3.24
PF12
  Top 0.254: MICRO1.50 54.64,69.08 58.64,69.08 64.39,74.83 P3.23
PF13
  Top 0.254: MICRO1.53 54.13,70.69 54.87,70.69 P3.20
PF14
  Top 0.254: MICRO1.54 54.33,71.6 54.33,71.95 60.8,78.42 P3.19
PF15
  Top 0.254: MICRO1.55 53.79,71.77 53.79,73.21 P3.18
PG0
  Top 0.254: MICRO1.56 53.25,71.94 53.25,74.47 59,80.21 P3.17
PG1
  Top 0.254: MICRO1.57 52.53,71.92 52.53,75.54 P3.16
PG2
  Top 0.254: MICRO1.87 33.14,72.27 33.14,75.19 P2.22
PG3
  Top 0.254: MICRO1.88 32.6,72.1 32.6,73.93 26.31,80.21 P2.21
PG4
  Top 0.254: MICRO1.89 32.06,71.94 32.06,72.67 P2.20
PG5
  Top 0.254: MICRO1.90 31.52,71.77 31.16,71.77 24.52,78.42 P2.19
PG6
  Top 0.254: P2.18 29.91,71.23 31.34,71.23 MICRO1.91
PG7
  Top 0.254: P2.17 22.9,78.24 22.9,76.44 28.65,70.69 31.16,70.69 34.61,67.24 MICRO1.92
PG8
  Top 0.254: P2.16 27.39,70.16 30.98,70.16 34.25,66.89 MICRO1.93
PG10
  Top 0.254: MICRO1.125 31,49.68 30.26,49.68 P1.20
PG11
  Top 0.254: P1.19 24.52,42.14 30.98,48.6 30.98,48.96 MICRO1.126
PG12
  Top 0.254: P1.18 31.52,47.35 31.52,48.78 MICRO1.127
PG13
  Top 0.254: MICRO1.128 32.06,48.62 32.06,46.09 26.31,40.34 P1.17
PG15
  Top 0.254: MICRO1.132 34.22,47.95 34.22,41.06 29.91,36.75 P1.13
PH0
  Top 0.254: MICRO1.23 54.64,51.48 60.44,51.48 P4.14 64.88,47.03 64.88,45.24 66.61,43.51 Q1.3
PH1
  Top 0.254: P4.13 66.19,47.53 61.7,52.02 54.87,52.02 52.16,54.73 MICRO1.24
REG_OR_USB
  Top 0.406: 3V3_REG.3 3.17,84.98 C21.1 5.49,87.73 D1.C 7.61,87.95 T1.2
SERVO1CURRENT
  Top 0.203: BACKPLANECON_.S36 39.99,7 38.73,8.26 38.73,11.56 41.27,14.1 46.61,14.1 51.69,19.18 77.6,19.18 77.85,19.43 77.85,48.39 77.6,48.64 70.46,48.64 P4.9
  Top 0.254: MICRO1.28 55.48,54.17 66.72,54.17 69.78,51.12 P4.9
SERVO1PWM
  Top 0.203: P4.33 48.23,25.36 47.88,25.02 46.86,25.02 45.09,23.24 45.09,20.95 43.81,19.68 37.97,19.68 37.21,18.92 17.65,18.92 17.14,18.41 17.14,9.52 BACKPLANECON_.S20
  Top 0.254: P4.33 48.23,29.57 46.07,31.72 46.07,46.63 MICRO1.4
SERVO2CURRENT
  Top 0.203: BACKPLANECON_.S35 37.26,6.94 36.2,8 36.2,12.32 37.47,13.59 40.01,13.59 41.02,14.61 46.35,14.61 51.44,19.68 77.09,19.68 77.34,19.94 77.34,47.88 77.09,48.13 69.22,48.13 68.45,48.9 68.45,50.65 P4.10
  Top 0.254: MICRO1.27 55.31,53.63 65.47,53.63 P4.10
SERVO2PWM
  Top 0.203: P4.32 48.64,30.95 48.64,29.08 50.67,27.05 50.67,25.53 49.66,24.51 47.12,24.51 45.59,22.99 45.59,20.7 44.07,19.18 38.23,19.18 37.47,18.41 20.19,18.41 19.68,17.91 19.68,9.52 BACKPLANECON_.S21
  Top 0.254: P4.32 46.61,32.98 46.61,46.81 45.41,48.01 MICRO1.5
STEP1  (via drill 0.25)
  Top 0.203: v31.11,24.51 v29.34,26.29
  Top 0.254: MICRO1.76 39.06,74.12 39.06,89.02 37.09,90.99 P2.33
  Bottom 0.203: BACKPLANECON_.S33 32.37,7.51 31.11,8.76 v31.11,24.51 | v29.34,26.29 29.34,28.83 24,34.16 24,35.94 13.84,46.1 13.84,49.4 17.65,53.21 17.65,54.99 39.24,76.58 39.24,88.84 37.09,90.99 P2.33
STEP2  (via drill 0.25)
  Top 0.203: v31.88,25.27 v30.1,27.05
  Top 0.254: MICRO1.75 39.6,74.29 39.6,90.27 P2.34
  Bottom 0.203: BACKPLANECON_.S43 37.45,19.7 v31.88,25.27 | v30.1,27.05 30.1,28.83 24.51,34.42 24.51,36.2 15.88,44.83 15.88,47.88 19.18,51.18 19.18,55.75 39.75,76.33 39.75,90.12 P2.34
STEPDIR1  (via drill 0.25)
  Top 0.203: v39.5,15.62 40.01,16.13 45.59,16.13 48.64,19.18 48.64,20.95 52.96,25.27 52.96,32.13 52.45,32.64 52.45,33.66 51.82,34.29 P4.28
  Top 0.254: P4.28 48.76,38.01 48.76,47.45 46.87,49.35 MICRO1.9
  Bottom 0.203: BACKPLANECON_.S44 39.99,15.13 v39.5,15.62
STEPDIR2  (via drill 0.25)
  Top 0.203: v35.69,15.37 38.23,15.37 39.5,16.64 45.34,16.64 48.13,19.43 48.13,21.21 52.45,25.53 52.45,30.35 51.82,30.99 P4.29
  Top 0.254: P4.29 51.82,33.16 48.23,36.75 48.23,47.35 46.5,49.07 MICRO1.8
  Bottom 0.203: BACKPLANECON_.S42 34.91,14.59 v35.69,15.37
STEPEN  (via drill 0.25)
  Top 0.203: v34.67,15.37 35.69,16.38 38.48,16.38 39.24,17.14 45.09,17.14 47.62,19.68 47.62,21.46 51.44,25.27 51.44,29.84 50.67,30.61 50.67,32.13 50.02,32.78 P4.30
  Top 0.254: P4.30 47.69,35.49 47.69,47.17 46.14,48.72 MICRO1.7
  Bottom 0.203: BACKPLANECON_.S34 34.91,7 33.66,8.26 33.66,14.35 v34.67,15.37
SWCLK
  Top 0.203: P1.36 10.14,58.29 6.48,58.29 5.97,57.78 5.97,49.59 4,47.62 JP7.2
  Top 0.254: MICRO1.109 28.31,58.3 P1.36
SWDIO
  Top 0.254: P2.4 12.3,63.69 29.01,63.69 MICRO1.105
  Bottom 0.203: P2.4 11.86,64.14 10.29,64.14 6.22,60.07 6.22,43.05 5.71,42.55 JP7.4
SWO
  Top 0.203: P1.12 31.15,36.2 29.34,36.2 27.05,33.91 4.45,33.91 4,34.35 4,37.4 JP7.6
  Top 0.254: P1.12 34.75,39.8 34.75,47.78 MICRO1.133
TETHER_RX
  Top 0.254: P1.16 32.6,44.83 32.6,48.45 MICRO1.129
  Bottom 0.203: BACKPLANECON_.S46 45.07,16.91 26.54,35.43 26.54,36.96 28.07,38.48 28.07,40.3 P1.16
TETHER_TX
  Top 0.254: MICRO1.124 34.25,53.67 30.76,50.17 28.96,50.17 22.9,44.11 21.1,44.11 P1.21
  Bottom 0.203: BACKPLANECON_.S45 42.53,18.68 26.04,35.18 26.04,36.96 20.95,42.04 20.95,43.9 P1.21
TURNCURRENT
  Top 0.203: BACKPLANECON_.S37 42.53,7 41.27,8.26 41.27,12.06 42.8,13.59 46.86,13.59 51.94,18.67 78.11,18.67 78.36,18.92 78.36,48.9 78.11,49.15 71.75,49.15 70.23,50.67 70.23,52.46 P4.8
  Top 0.254: MICRO1.29 55.65,54.71 67.98,54.71 P4.8
TURNPWM1  (via drill 0.25)
  Top 0.203: BACKPLANECON_.S39 47.61,7 46.35,8.26 46.35,11.56 52.45,17.65 79.12,17.65 79.38,17.91 79.38,51.94 v79.12,52.2
  Top 0.254: P3.31 71.57,67.64 68.7,64.77 55.99,64.77 MICRO1.42
  Bottom 0.203: v79.12,52.2 80.14,52.2 80.39,52.45 80.39,67.44 80.14,67.69 73.42,67.69 P3.31
TURNPWM2  (via drill 0.25)
  Top 0.203: BACKPLANECON_.S38 45.07,7 43.81,8.26 43.81,11.81 44.83,12.83 46.86,12.83 52.2,18.16 78.61,18.16 78.87,18.41 78.87,50.93 v78.61,51.18
  Top 0.254: P3.30 67.44,65.31 55.82,65.31 MICRO1.43
  Bottom 0.203: v78.61,51.18 80.64,51.18 80.9,51.44 80.9,68.71 80.64,68.96 73.03,68.96 72.01,67.94 70.08,67.94 P3.30
USB_D+  (via drill 0.25)
  Top 0.203: RN1.3 6.2,95.65 6.73,95.12 v7.49,95.12 | v11.56,87.76 11.56,68.03 P2.5
  Top 0.254: P2.5 11.95,65.85 13.56,64.23 29.19,64.23 30.39,63.03 MICRO1.104
  Bottom 0.203: v7.49,95.12 10.54,95.12 11.56,94.11 v11.56,87.76
USB_D-  (via drill 0.25)
  Top 0.203: RN1.4 7,96.12 7.24,95.89 v8.26,95.89 | v12.32,87 12.32,68.96 13.08,68.2 13.08,66.42 13.16,66.42 P2.6
  Top 0.254: P2.6 14.82,64.77 29.37,64.77 30.74,63.39 MICRO1.103
  Bottom 0.203: v8.26,95.89 11.3,95.89 12.32,94.87 v12.32,87
V_CAP_1  (via drill 0.51)
  Top 0.254: P3.2 44.27,92.43 44.27,90.63 44.99,89.91 44.99,74.29 MICRO1.71 | MICRO1.71 | MICRO1.71 43.55,72.85 v43.55,71.95
  Bottom 0.254: v43.55,71.95 44.48,72.88 C13.1
V_CAP_2  (via drill 0.51)
  Top 0.254: P2.3 10.15,64.05 11.41,62.79 12.48,62.79 12.84,63.15 28.74,63.24 29.6,62.38 MICRO1.106 30.35,61.62 31.43,61.62 v31.66,61.85
  Bottom 0.254: v31.66,61.85 C17.1
VSEL1  (via drill 0.25)
  Top 0.203: v49.4,20.19 49.4,20.95 53.61,25.16 P4.27
  Top 0.254: P4.27 53.61,34.95 49.3,39.26 49.3,47.63 47.23,49.71 MICRO1.10
  Bottom 0.203: BACKPLANECON_.S47 47.61,18.4 v49.4,20.19
VSEL2  (via drill 0.25)
  Top 0.203: v50.93,21.46 54.74,25.27 54.74,33.66 54.23,34.42 54.23,35.69 53.61,36.3 P4.26
  Top 0.254: P4.26 49.84,40.52 49.84,47.78 47.5,50.12 MICRO1.11
  Bottom 0.203: BACKPLANECON_.S48 50.15,20.69 v50.93,21.46
VSEN1  (via drill 0.25)
  Top 0.203: P4.22 57.78,39.76 57.78,37.97 58.8,36.96 v58.8,22.23 | v47.37,22.23 47.12,21.97 47.12,19.94 44.83,17.65 38.99,17.65 38.23,16.89 34.16,16.89 32.64,15.37 v28.32,15.37
  Top 0.254: P4.22 52,45.55 52,48.42 48.91,51.51 MICRO1.15
  Bottom 0.203: v58.8,22.23 v47.37,22.23 | v28.32,15.37 28.32,5.71 BACKPLANECON_.S8
VSEN2  (via drill 0.25)
  Top 0.203: P4.23 58.04,35.92 v58.04,22.99 | v48.13,22.99 47.12,22.99 46.61,22.48 46.61,20.19 44.58,18.16 38.73,18.16 37.97,17.4 33.91,17.4 32.64,16.13 v29.08,16.13
  Top 0.254: P4.23 57.2,38.55 51.46,44.29 51.46,48.24 48.56,51.14 MICRO1.14
  Bottom 0.203: v58.04,22.99 v48.13,22.99 | v29.08,16.13 29.08,4.45 27.81,3.17 25.95,3.17 BACKPLANECON_.S7
VSEN3  (via drill 0.25)
  Top 0.203: P4.24 56.01,37.95 56.01,36.2 57.28,34.92 v57.28,23.75 | v48.9,23.75 47.12,23.75 46.1,22.73 46.1,20.45 44.32,18.67 38.48,18.67 37.72,17.91 33.66,17.91 32.64,16.89 v29.84,16.89
  Top 0.254: P4.24 50.92,43.04 50.92,48.1 48.21,50.81 MICRO1.13
  Bottom 0.203: v57.28,23.75 v48.9,23.75 | v29.84,16.89 29.84,4.45 28.07,2.67 23.92,2.67 BACKPLANECON_.S6
VUSB
  Top 0.203: JP1.P1 7.62,98.11 10.54,95.19 T1.1 13.08,87.27 13.08,71.75 14.86,69.98 14.86,68.2 15.42,67.64 P2.8
  Top 0.254: P2.8 17.33,65.85 29.73,65.85 31.51,64.06 MICRO1.101

## Text on the board
tNames: ARM_BOOT | ARM_RST | IMU_BOOT | IMU_RST | USB | OLED Disp | STEP1 | GRN | RED | STEP2 | +3V3 | UART / / / I2C | L_DIN | BLU | YEL | GND | +3V3 | GND | OLED_SCL | BILGEPWM | LED_DOUT | +3V3 | USB_D+ | TURNPWM1 | OLED_SDA | CLAWCURRENT | +3V3 | VUSB | TURNPWM2 | GND | USB_D- | SWDIO | LEDPWM1 | GND | LEDPWM3 | SWCLK | MOTOR_TX | GND | TURNCURRENT | LEDPWM2 | SERVO2CURRENT | MOTOR_EN | 1 | NRST | +3V3 | MOTOR_RX | LASER_RX | SERVO1CURRENT | LEDPWM4 | FUSEDETECTP | CLAWPWM1 | LASER_TX | TETHER_TX | TETHER_RX | VSEN1 | FUSEDETECTM | VSEN3 | LEDPWM5 | SWD Header | CLAWPWM2 | VSEL2 | STEPDIR1 | STEPEN | VSEN2 | IMU_SDA | SERVO2PWM | IMU_SCL | VSEL1 | STEPDIR2 | SERVO1PWM | +3V3 | Micro Board MK2 / Purdue IEEE ROV 2015 / Designed by Nick Molo